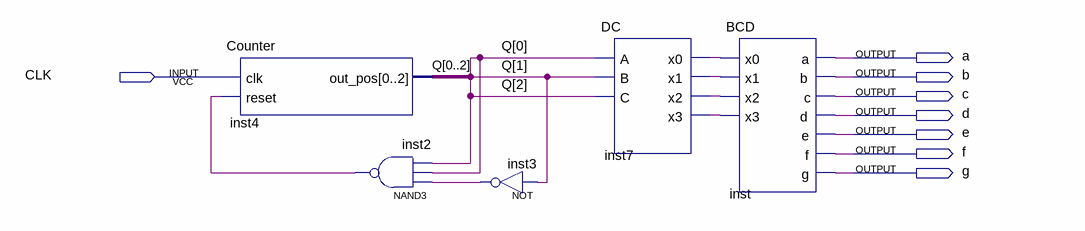
[diagram p0: schematic sheet]
// Quartus schematic main_prom.bdf as structural Verilog: 5 symbols, 8 pins
module main_prom (
  input  CLK,
  output a,
  output b,
  output c,
  output d,
  output e,
  output f,
  output g
);

  wire inst2_out, inst3_out, inst7_x0, inst7_x1, inst7_x2, inst7_x3;
  wire [2:0] Q;

  Counter inst4 (.clk(CLK), .reset(inst2_out), .out_pos({Q[0], Q[1], Q[2]}));
  nand inst2 (inst2_out, inst3_out, Q[0], Q[2]);
  not inst3 (inst3_out, Q[1]);
  DC inst7 (.A(Q[0]), .B(Q[1]), .C(Q[2]), .x0(inst7_x0), .x1(inst7_x1), .x2(inst7_x2), .x3(inst7_x3));
  BCD inst (
    .x0(inst7_x0), .x1(inst7_x1), .x2(inst7_x2), .x3(inst7_x3), .a(a), .b(b), .c(c), .d(d), .e(e), .f(f),
    .g(g));
endmodule
